# EAGLE design mybiosphere_output_board (EAGLE 8.1.0)
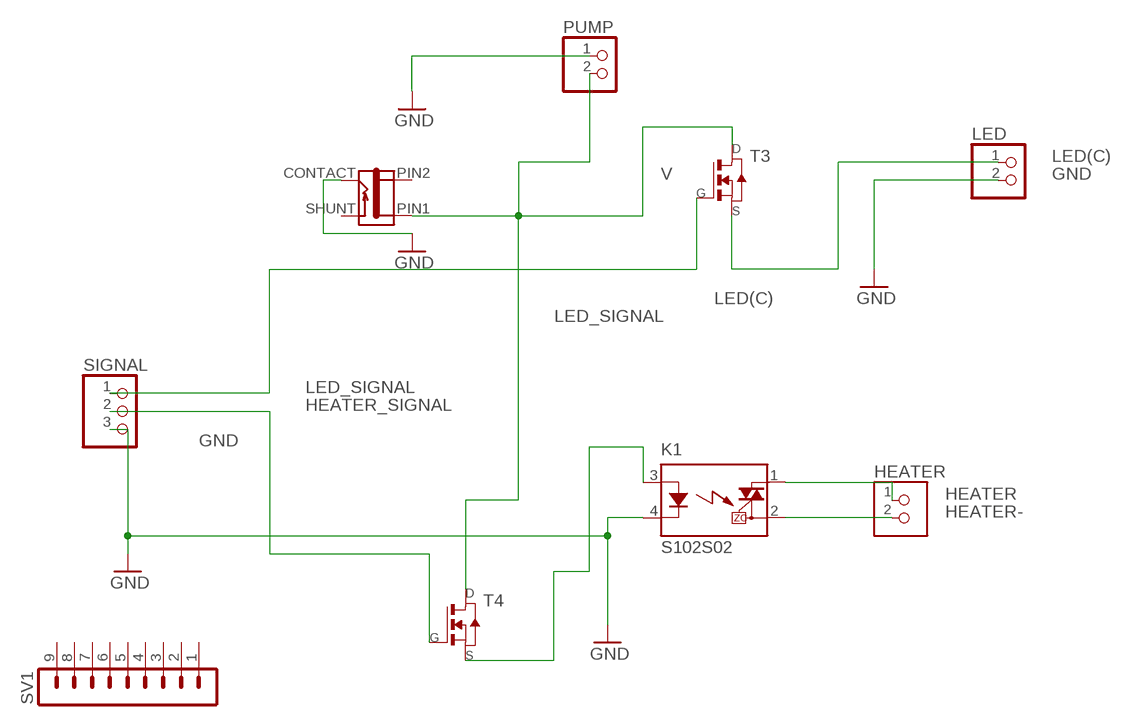
[diagram p0: schematic, sheet 1]

## Parts
HEATER  TERM-1X02-FABLAB  [ED555DS-2DS]
J1  JACK-2.1MM  [PJ-002AH-SMT]
K1  S102S02  [S202S02]
LED  PINHD-1X2/90  [1X02/90]
PUMP  PINHD-1X2/90  [1X02/90]
SIGNAL  PINHD-1X3  [1X03]
SV1  MA09-1  [MA09-1]
T3  NMOSFETTO252  [TO252]
T4  NMOSFETTO252  [TO252]

## Nets
GND: J1.CONTACT K1.4(K) LED.2 PUMP.1 SIGNAL.3
HEATER: HEATER.1 K1.1(DS1)
HEATER-: HEATER.2 K1.2(DS2)
HEATER_SIGNAL: SIGNAL.2 T4.1(G)
LED(C): LED.1 T3.2(S)
LED_SIGNAL: SIGNAL.1 T3.1(G)
N$3: K1.3(A) T4.2(S)
V: J1.PIN1 PUMP.2 T3.3(D) T4.3(D)
Unconnected: SV1.1 SV1.2 SV1.3 SV1.4 SV1.5 SV1.6 SV1.7 SV1.8 SV1.9

## Power pins joined to a net without a drawn wire
PIN2: J1.PIN2
SHUNT: J1.SHUNT

## Library data of the parts
HEATER = fab:TERM-1X02: 3.5mm terminal block, 2 positions ED555-2DS as found in the fablab inventory. Stolen from Adafruit <http://www.ladyada.net/library/pcb/eaglelibrary.html>, adapted by Zaerc.
J1 = fab:JACK-2.1MM: SMD DC power jack PJ-002AH-SMT As found in the fablab inventory. Made by Zaerc.
K1 = relay:S*02S02: IT(rms) 8A, Zero Cross type SIP 4pin Triac output SSR Source: http://sharp-world.com/products/device/lineup/data/pdf/datasheet/s102s02_e.pdf; OC_FARNELL: unknown; OC_NEWARK: unknown
LED PUMP = pinhead:PINHD-1X2: PIN HEADER
SIGNAL = pinhead:PINHD-1X3: PIN HEADER
SV1 = con-lstb:MA09-1: PIN HEADER; OC_FARNELL: unknown; OC_NEWARK: unknown
T3 T4 = fab:NMOSFET: MOS FET

## Board
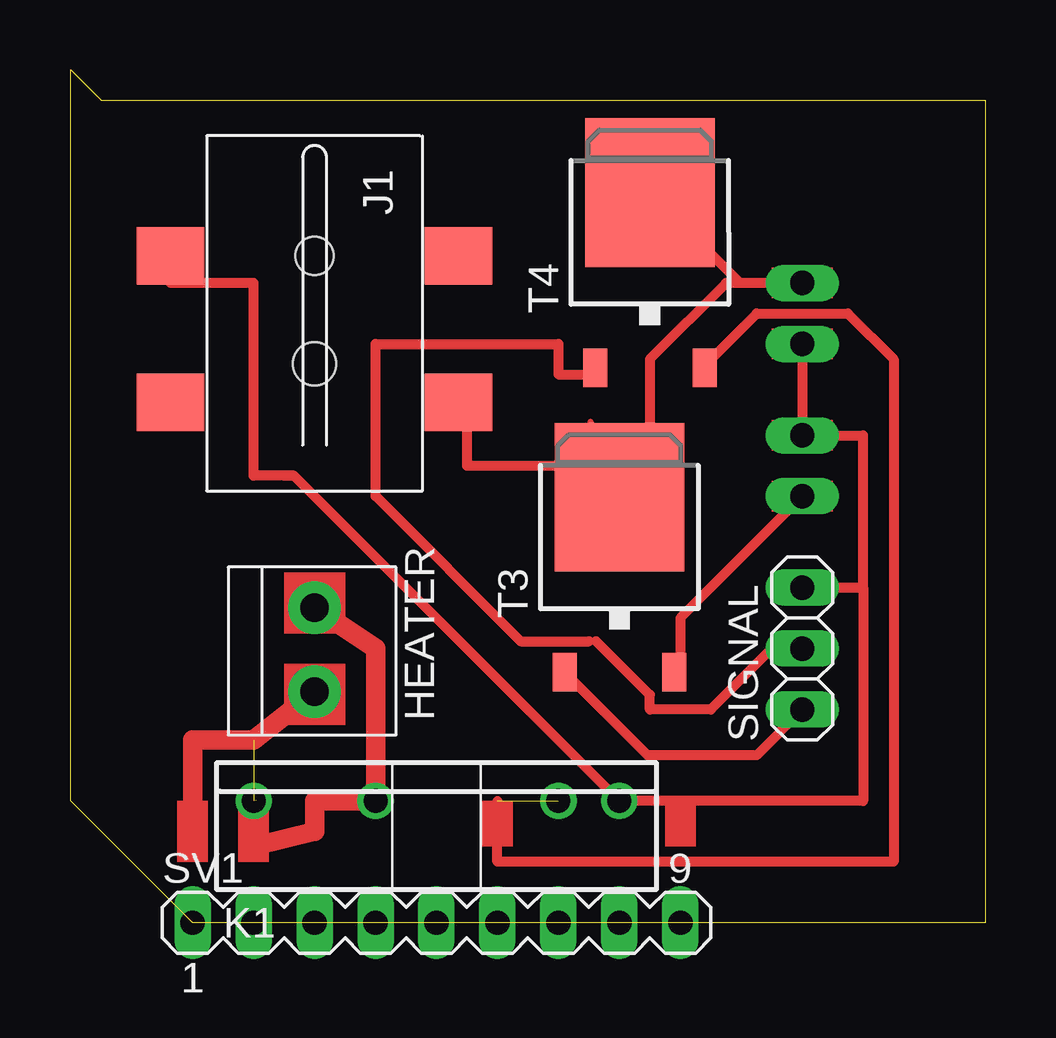
[diagram p1: board, top side]
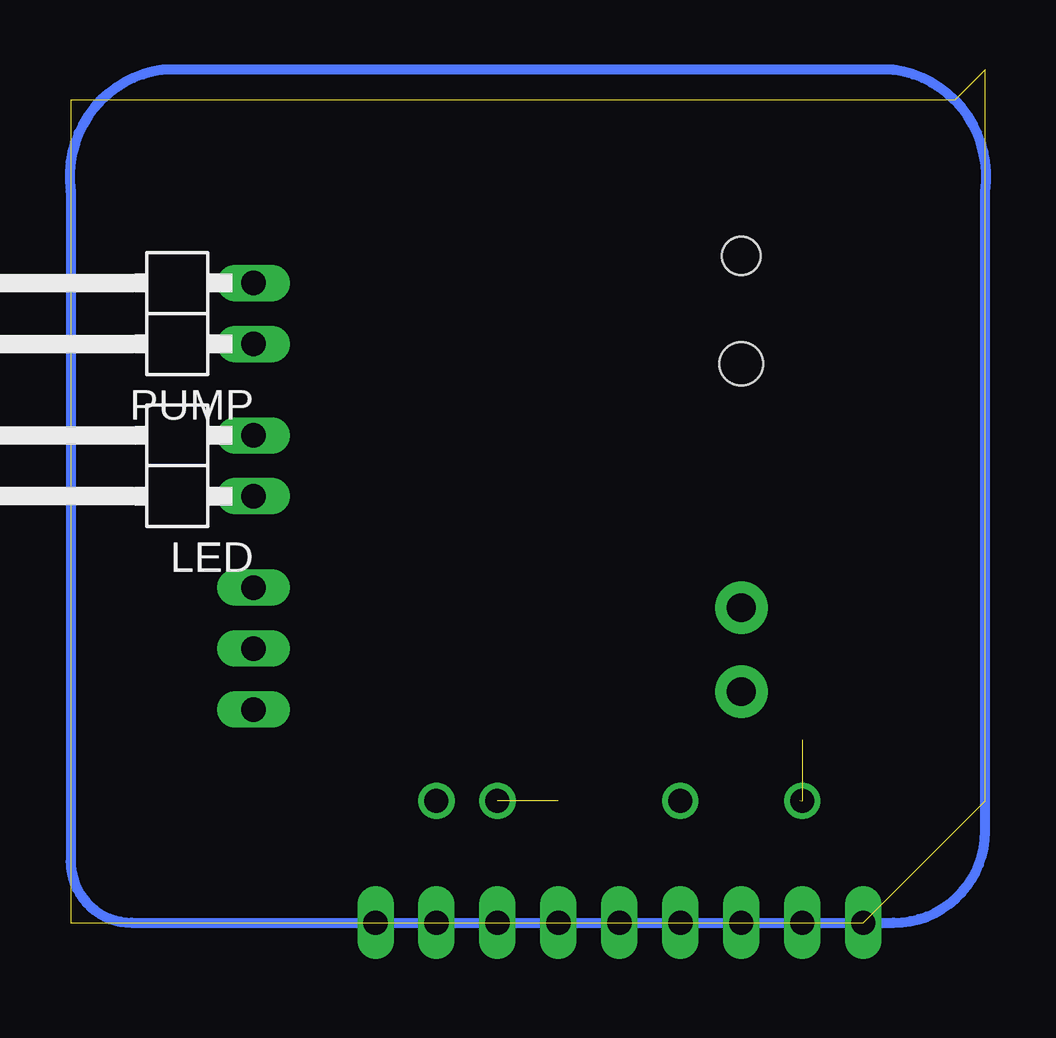
[diagram p2: board, bottom side, seen from below]

No outline drawn. Coordinates in mm, seen from the top.
Copper layers (1*16): Top 0.035mm / dielectric 1.5mm / Bottom 0.035mm
Design rules "default": minimum track width 10mil, minimum drill 24mil, track to track 8mil, track to pad 8mil, pad to pad 8mil, via to via 8mil, smd to smd 8mil, copper to edge 40mil, drill to drill 8mil, minimum pad ring 10mil, minimum via ring 8mil, stop-mask expansion 4mil, vias tented up to drill 0mil, thermal gap 10mil

### Footprints (pad centres in the part's own frame; a part is rotated, then mirrored left to right if it is on the bottom)
ED555DS-2DS = drill 1.2 pad 2.184: 1 1.8,0; 2 -1.7,0
PJ-002AH-SMT = smd 2.4 x 2.8: CONTACT -2.4,-6; PIN1 3.7,6; PIN2 -2.4,6; SHUNT 3.7,-6 | hole 1.6: -2.4,0 | hole 1.8: 2.1,0
S202S02 = drill 1: 1 -7.62,0; 2 -2.54,0; 3 5.08,0; 4 7.62,0
1X02/90 = drill 1.016 long: 1 -1.27,-3.81; 2 1.27,-3.81
1X03 = drill 1.016 long: 1 -2.54,0; 2 0,0; 3 2.54,0
MA09-1 = drill 1.016 long: 1 -10.16,0; 2 -7.62,0; 3 -5.08,0; 4 -2.54,0; 5 0,0; 6 2.54,0; 7 5.08,0; 8 7.62,0; 9 10.16,0
TO252 = smd 1 x 1.6: 1 -2.28,-4.8; 2 2.28,-4.8 | smd 5.4 x 6.2: 3 0,2.5

### Placement (x,y rotation side)
HEATER  -7.62,15.24 270 top
J1  -7.62,29.21 270 top
K1  -2.54,8.89 0 top
LED  16.51,22.86 90 bottom
PUMP  16.51,29.21 90 bottom
SIGNAL  12.7,15.24 90 top
SV1  -2.54,3.81 0 top
T3  5.08,19.05 0 top
T4  6.35,31.75 0 top

### Tracks (layer width: path | path; a pad name or v marks a point on that pad's centre or on a via)
GND
  Top 0.254: 12.8,24 LED.2
  Top 0.406: PUMP.1 LED.2 15.24,24.13 15.24,17.78 | 15.24,17.78 15.24,8.89 7.62,8.89 | J1.CONTACT -13.62,30.48 -10.16,30.48 -10.16,22.45 -8.48,22.45 | SIGNAL.3 15.24,17.78 | -8.89,22.45 -8.48,22.45 | -8.48,22.45 K1.4 7.62,8.89 | 7.62,8.89 7.62,7.62 7.62,8.89
HEATER  (2 unrouted)
  Top 0.254: -7.62,13.34 HEATER.1 -7.77,13.26
  Top 0.813: HEATER.1 -10.16,11.43 -12.7,11.43 -12.7,7.62
HEATER-
  Top 0.254: -5.26,8.91 K1.2 | HEATER.2 -7.54,16.92
  Top 0.813: HEATER.2 -5.08,15.24 K1.2 -7.62,8.89 -7.62,7.62 -10.16,6.99
HEATER_SIGNAL
  Top 0.254: 4.12,15.54 3.81,15.54 2.52,15.54 | T4.1 3.89,26.75 | 12.57,15.09 SIGNAL.2
  Top 0.406: SIGNAL.2 11.43,15.24 8.89,12.7 6.35,12.7 6.35,13.31 4.12,15.54 | 3.79,26.67 T4.1 4.07,26.67 2.54,26.67 2.54,27.94 -5.08,27.94 -5.08,21.59 0.96,15.54 3.81,15.54
LED(C)
  Top 0.254: T3.2 7.54,14.4 | 12.57,21.49 LED.1
  Top 0.406: LED.1 7.62,16.51 7.62,14.51 T3.2
LED_SIGNAL
  Top 0.254: T3.1 2.97,14.17 | 12.57,12.57 SIGNAL.1
  Top 0.406: SIGNAL.1 10.79,10.79 6.25,10.79 T3.1
N$1  (6 unrouted)
N$2
  Bottom 0.406: -13.97,39.37 16.51,39.37 arc-90 20.32,34.29 20.32,6.35 arc-90 17.78,3.81 -13.97,3.81 arc-90 -17.78,7.62 -17.78,34.29 arc-90 -13.97,39.37
N$3  (1 unrouted)
  Top 0.254: 8.69,26.98 T4.2
  Top 0.406: T4.2 8.63,27.05 10.79,29.21 14.61,29.21 16.51,27.3 16.51,6.35 0,6.35 0,8.89
V
  Top 0.254: 3.89,22.86 5.03,21.72 T3.3 3.89,22.86 | 12.57,30.63 PUMP.2 | T4.3 6.4,34.06 | 3.89,24.69 3.89,22.86
  Top 0.406: PUMP.2 10.12,30.48 | 10.12,30.48 T4.3 | 10.12,30.48 9.53,30.48 6.35,27.3 6.35,21.59 5.12,21.59 T3.3 5.08,22.86 -1.27,22.86 -1.27,25.51 J1.PIN1
(copper drawn outside any net)
  shapes: Top area x16